# EAGLE schematic Raspi-TPUART (EAGLE 7.6.0)
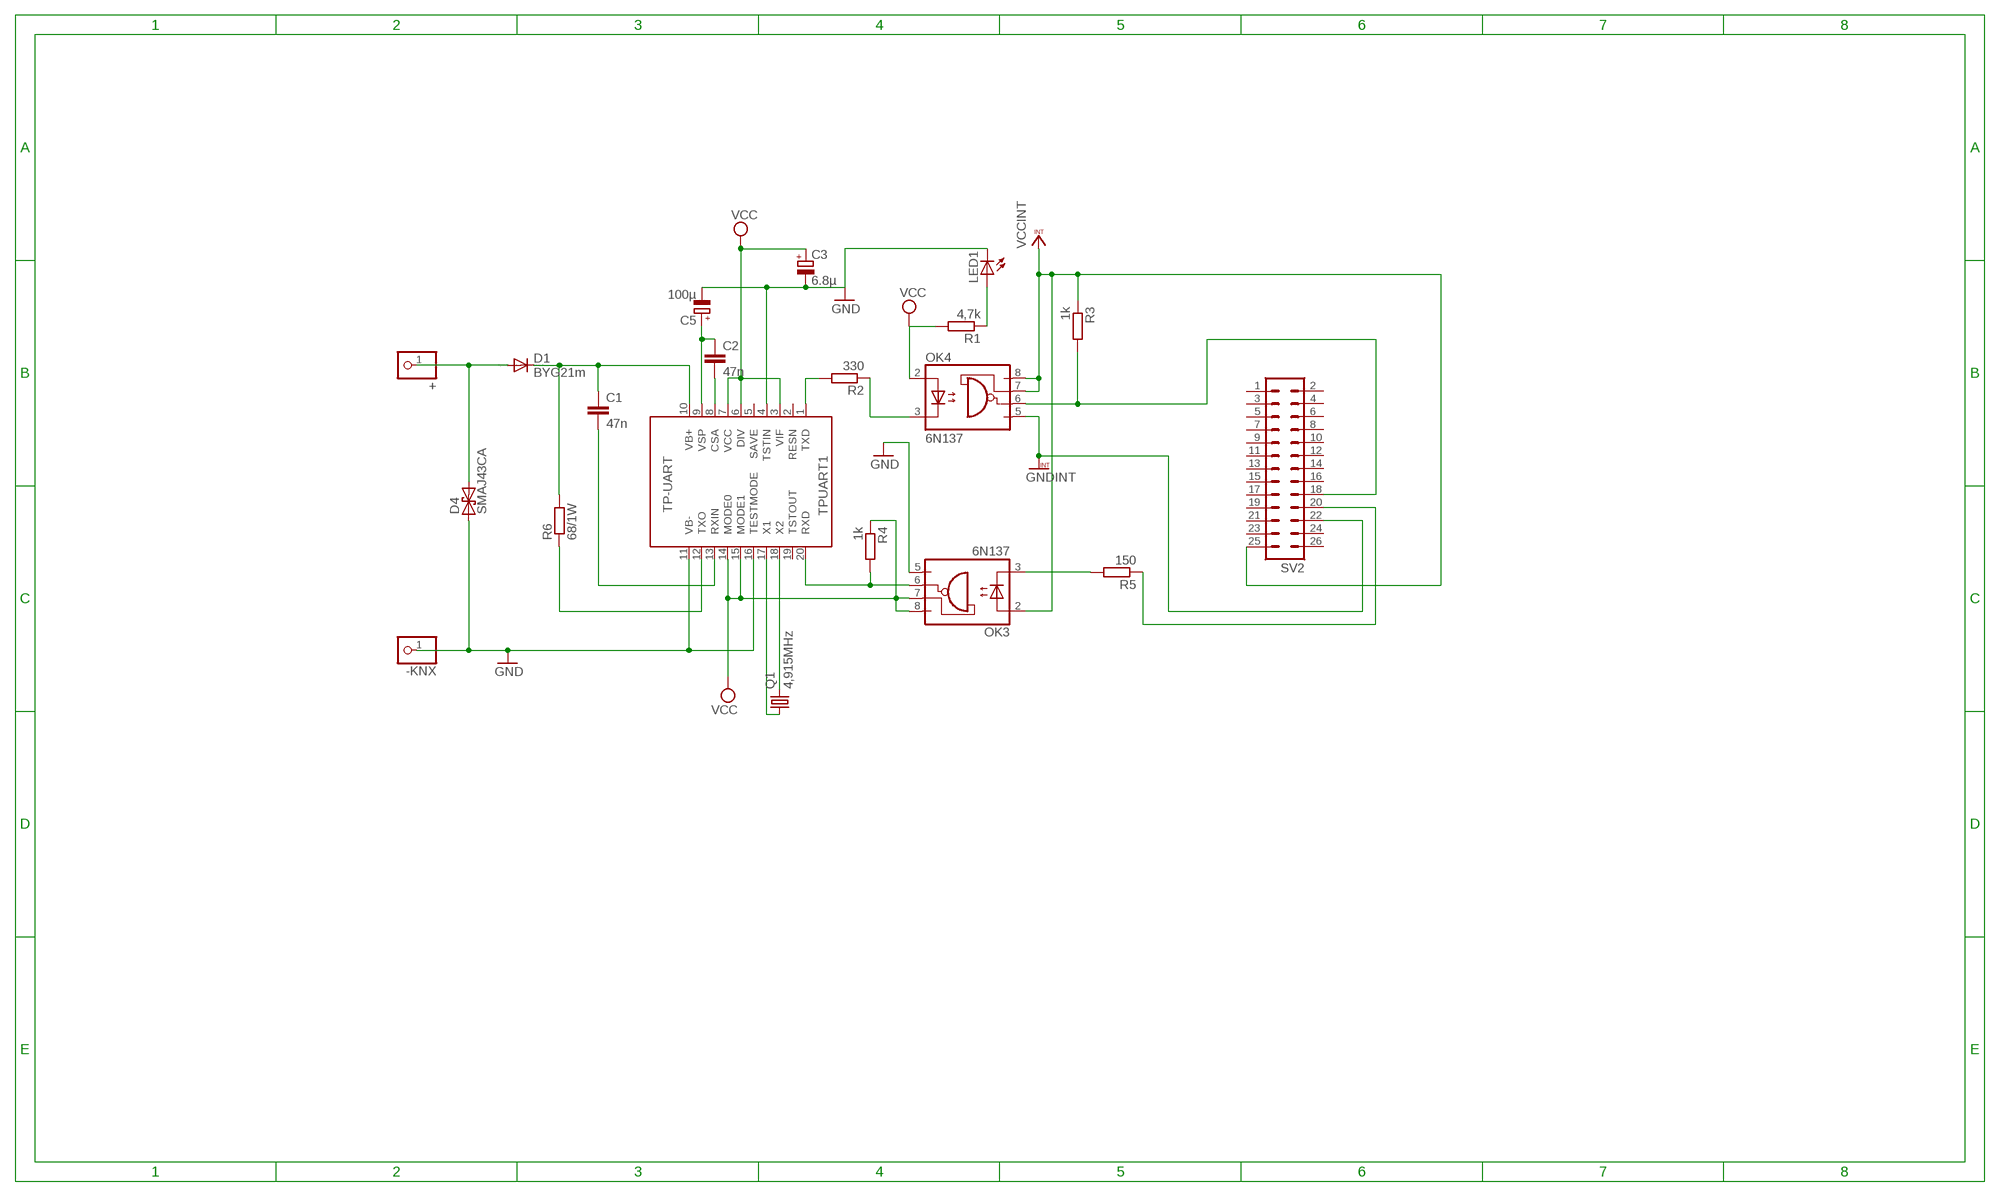
[diagram p0: schematic, sheet 1]

## Parts
+  PINHD-1X1  [1X01]
-KNX  PINHD-1X1  [1X01]
C1  47n  C-EUC1206  [C1206]
C2  47n  C-EUC1206  [C1206]
C3  6.8µ  CPOL-EUCT7343  [CT7343]
C5  100µ  CPOL-EUCT7343  [CT7343]
D1  BYG21m  ES2D  [SMB]
D4  SMAJ43CA  BZW04XXB  [DO214AA]
LED1  LEDKA-3528ASYC  [KA-3528ASYC]
OK3  6N137  [DIL8-SMD]
OK4  6N137  [DIL8-SMD]
Q1  4,915MHz  CRYSTALHC49UP  [HC49UP]
R1  4,7k  R-EU_M1206  [M1206]
R2  330  R-EU_M1206  [M1206]
R3  1k  R-EU_M1206  [M1206]
R4  1k  R-EU_M1206  [M1206]
R5  150  R-EU_M1206  [M1206]
R6  68/1W  R-EU_R2512  [R2512]
SV2  MA13-2  [MA13-2]
TPUART1  TP-UART  [SOIC20]

## Nets
ARDUINO_RXD: OK4.6(VO) R3.2 SV2.18
GND [supply]: -KNX.1 C3.- C5.- D4.A LED1.C OK3.5(GND) TPUART1.4(TSTIN) TPUART1.11(VB-) TPUART1.16(TESTMODE)
GNDINT [supply]: OK4.5(GND) SV2.22
KNX+ [supply]: +.1 D1.A D4.C
N$1 [supply]: C1.1 D1.C R6.2 TPUART1.10(VB+)
N$3: R6.1 TPUART1.12(TXO)
N$4: C1.2 TPUART1.13(RXIN)
N$5: C2.2 TPUART1.8(CSA)
N$6: C2.1 C5.+ TPUART1.9(VSP)
N$7: Q1.1 TPUART1.17(X1)
N$8: Q1.2 TPUART1.18(X2)
N$9: R2.2 TPUART1.1(TXD)
N$10: OK4.3(C) R2.1
N$11: R5.1 SV2.20
N$12: OK3.6(VO) R4.2 TPUART1.20(RXD)
N$14: OK3.3(C) R5.2
N$18: LED1.A R1.1
VCC [supply]: C3.+ OK3.7(VE) OK3.8(VCC) OK4.2(A) R1.2 R4.1 TPUART1.3(VIF) TPUART1.6(DIV) TPUART1.7(VCC) TPUART1.14(MODE0) TPUART1.15(MODE1)
VCCINT [supply]: OK3.2(A) OK4.7(VE) OK4.8(VCC) R3.1 SV2.25
Unconnected: SV2.1 SV2.2 SV2.3 SV2.4 SV2.5 SV2.6 SV2.7 SV2.8 SV2.9 SV2.10 SV2.11 SV2.12 SV2.13 SV2.14 SV2.15 SV2.16 SV2.17 SV2.19 SV2.21 SV2.23 SV2.24 SV2.26 TPUART1.2(RESN) TPUART1.5(SAVE) TPUART1.19(TSTOUT)

## Library data of the parts
+ -KNX = pinhead:PINHD-1X1: PIN HEADER
C1 C2 = resistor:C-EU: CAPACITOR, European symbol
C3 C5 = resistor:CPOL-EU: POLARIZED CAPACITOR, European symbol
D1 = diode:ES2D: DIODE super fast rectifier, 2 A
D4 = diode:BZW04XXB: DIODE uni and bidirectional supressor diode
LED1 = led:LED: LED OSRAM: - CHIPLED LG R971, LG N971, LY N971, LG Q971, LY Q971, LO R971, LY R971 LH N974, LH R974 LS Q976, LO Q976, LY Q976 LO Q996 - Hyper CHIPLED LW Q18S LB Q993, LB Q99A, LB R99A - SideLED LS A670, LO A670, LY A670, LG A670, LP A670 LB A673, LV A673, LT A673, LW A673 LH A674 LY A675 LS A676, LA A676, LO A676, LY A676, LW A676 LS A679, LY A679, LG A679 - Hyper Micro SIDELED® LS Y876, LA Y876, LO Y876, LY Y876 LT Y87S - SmartLED LW L88C, LW L88S LB L89C, LB L89S, LG L890 LS L89K, LO L89K, LY L89K LS L896, LA L896, LO L896, LY L896 - TOPLED LS T670, LO T670, LY T670, LG T670, LP T670 LSG T670, LSP T670, LSY T670, LOP T670, LYG T670 LG T671, LOG T671, LSG T671 LB T673, LV T673, LT T673, LW T673 LH T674 LS T676, LA T676, LO T676, LY T676, LB T676, LH T676, LSB T676, LW T676 LB T67C, LV T67C, LT T67C, LS T67K, LO T67K, LY T67K, LW E67C LS E67B, LA E67B, LO E67B, LY E67B, LB E67C, LV E67C, LT E67C LW T67C LS T679, LY T679, LG T679 LS T770, LO T770, LY T770, LG T770, LP T770 LB T773, LV T773, LT T773, LW T773 LH T774 LS E675, LA E675, LY E675, LS T675 LS T776, LA T776, LO T776, LY T776, LB T776 LHGB T686 LT T68C, LB T68C - Hyper Mini TOPLED® LB M676 - Mini TOPLED Santana® LG M470 LS M47K, LO M47K, LY M47K Source: http://www.osram.convergy.de LUXEON: - LUMILED® LXK2-PW12-R00, LXK2-PW12-S00, LXK2-PW14-U00, LXK2-PW14-V00 LXK2-PM12-R00, LXK2-PM12-S00, LXK2-PM14-U00 LXK2-PE12-Q00, LXK2-PE12-R00, LXK2-PE12-S00, LXK2-PE14-T00, LXK2-PE14-U00 LXK2-PB12-K00, LXK2-PB12-L00, LXK2-PB12-M00, LXK2-PB14-N00, LXK2-PB14-P00, LXK2-PB14-Q00 LXK2-PR12-L00, LXK2-PR12-M00, LXK2-PR14-Q00, LXK2-PR14-R00 LXK2-PD12-Q00, LXK2-PD12-R00, LXK2-PD12-S00 LXK2-PH12-R00, LXK2-PH12-S00 LXK2-PL12-P00, LXK2-PL12-Q00, LXK2-PL12-R00 Source: www.luxeon.com KINGBRIGHT: KA-3528ASYC Source: www.kingbright.com
OK3 OK4 = optocoupler:6N137: MOTOROLA OPTO COUPLER
Q1 = crystal:CRYSTAL: CRYSTAL; OC_FARNELL: unknown; OC_NEWARK: unknown
R1-R6 = resistor:R-EU_: RESISTOR, European symbol
SV2 = con-lstb:MA13-2: PIN HEADER; OC_FARNELL: unknown; OC_NEWARK: unknown
TPUART1 = tpuart-actiface:TP-UART: Siemens TP-UART

## Net classes
0 default: width 0.3 mm
1 supply: width 0.6 mm